# EasyEDA Pro project board.epro

# Schematic Schematic1
Board Name: Board1; Create Date: 2026-03-25; Page Name: P1; Project Name: jog controller; Schematic Name: Schematic1; Update Date: 2026-03-25; Company: EasyEDA.com; Page Size: A4; Version: V1.0
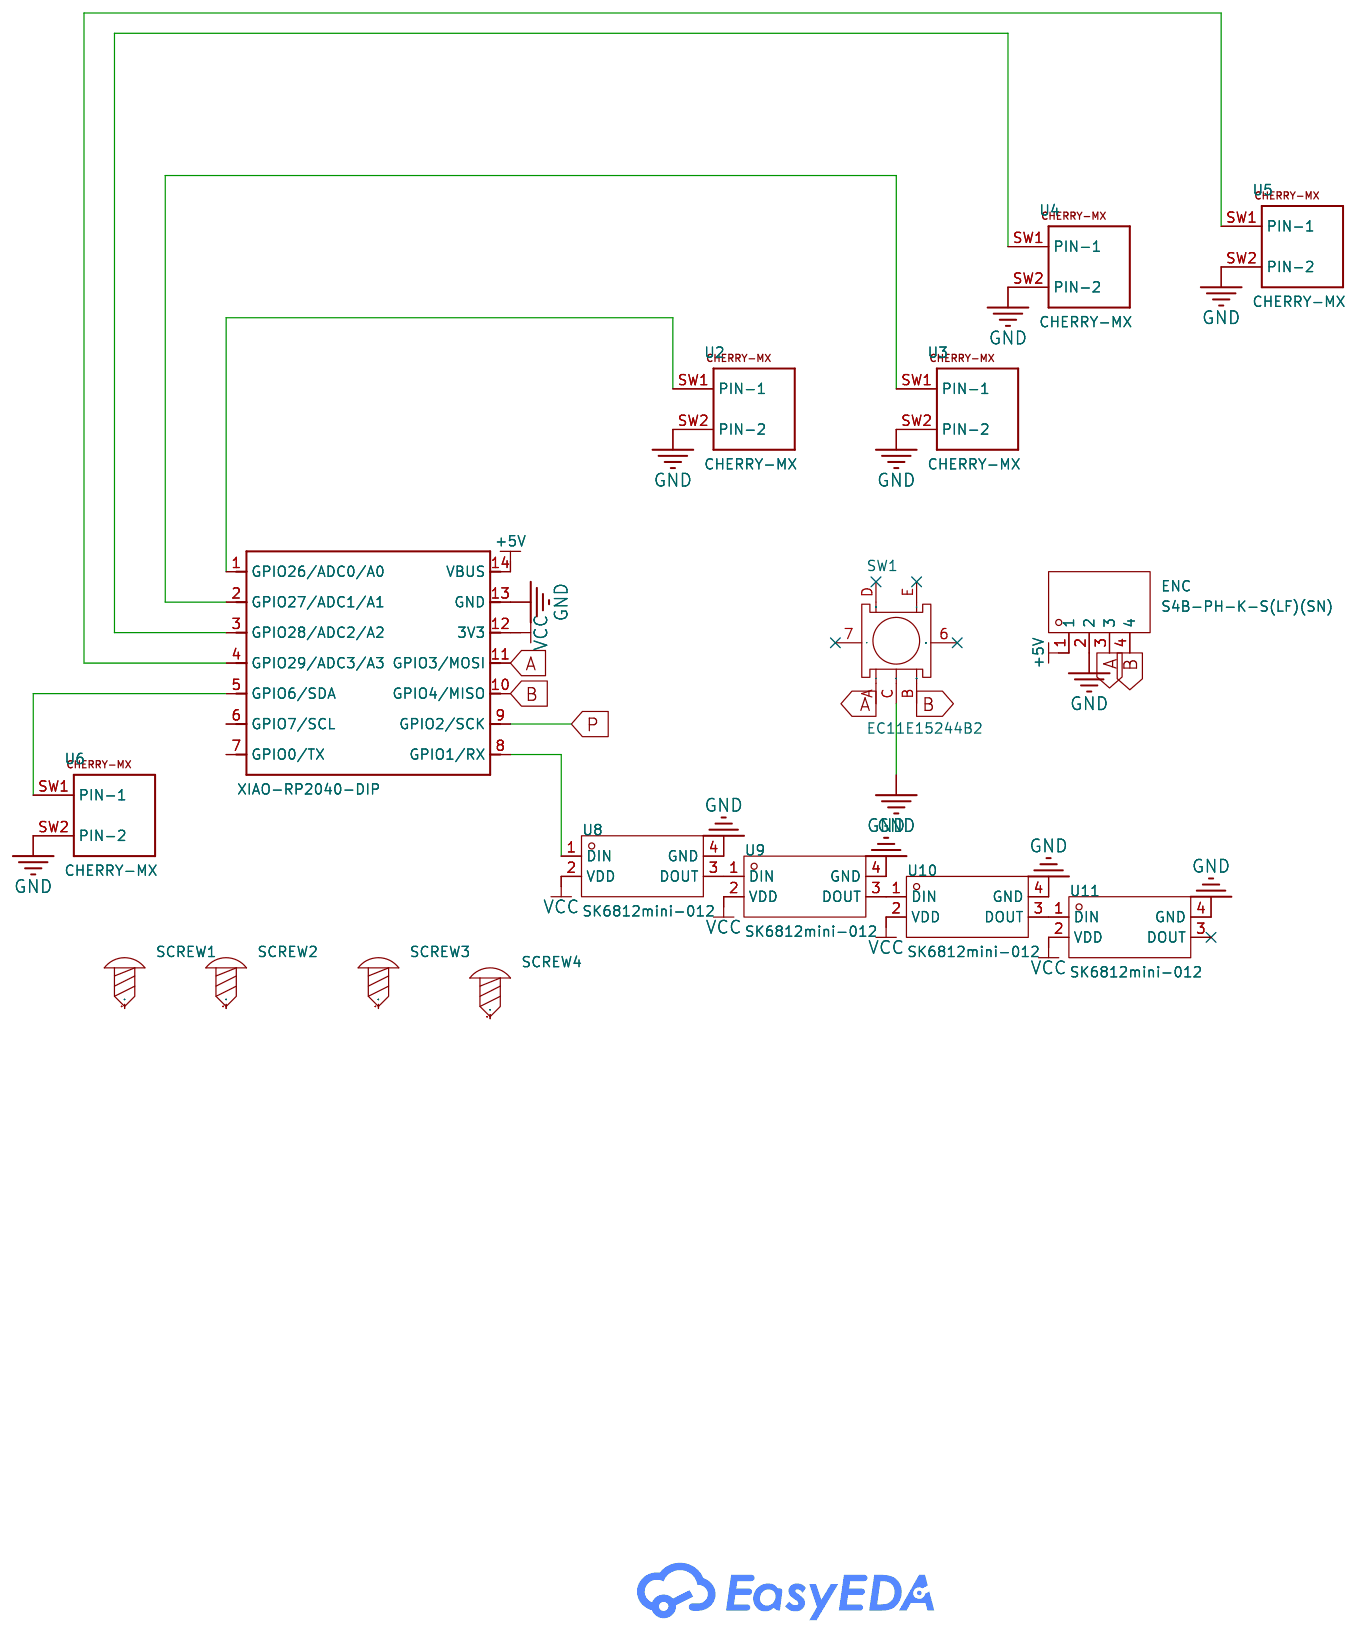
[diagram p0: schematic sheet]

## Parts
ENC  S4B-PH-K-S(LF)(SN)  [CONN-TH_4P-P2.00_S4B-PH-K-S-LF-SN]
SCREW1  -  [Screw-Hole-M3]
SCREW2  -  [Screw-Hole-M3]
SCREW3  -  [Screw-Hole-M3]
SCREW4  -  [Screw-Hole-M3]
SW1  EC11E15244B2  [SW-TH_EC11XXXXXXXX]
U1  XIAO-RP2040-DIP  [XIAO-RP2040-DIP]
U2  CHERRY-MX  [CHERRY-MX]
U3  CHERRY-MX  [CHERRY-MX]
U4  CHERRY-MX  [CHERRY-MX]
U5  CHERRY-MX  [CHERRY-MX]
U6  CHERRY-MX  [CHERRY-MX]
U8  SK6812mini-012  [LED-SMD_4P-L3.7-W3.5-P1.75-BR-SK6812MINI]
U9  SK6812mini-012  [LED-SMD_4P-L3.7-W3.5-P1.75-BR-SK6812MINI]
U10  SK6812mini-012  [LED-SMD_4P-L3.7-W3.5-P1.75-BR-SK6812MINI]
U11  SK6812mini-012  [LED-SMD_4P-L3.7-W3.5-P1.75-BR-SK6812MINI]

## Library data of the parts
ENC = S4B-PH-K-S(LF)(SN): Pins Structure:1x4P Pitch:2mm Mounting Type:Right Angle Reference Series:PH Number of Pins:4P Number of Rows:1 Number of PINs Per Row:4 Row Spacing:- Current Rating:2A Contact Material:Brass Contact Plating:Tin Operating Temperature:-25℃~+85℃ Operating Te; LCSC Part Name: 1x4P 间距:2mm 弯插 系列:PH; Supplier Part: C157926; Manufacturer: JST; Supplier Footprint: 弯插,P=2mm; JLCPCB Part Class: Extended Part; Datasheet: https://item.szlcsc.com/datasheet/S4B-PH-K-S(LF)(SN)/169274.html; Supplier: LCSC; Pins Structure: 1x4P; Pitch: 2mm; Mounting Type: Right Angle; Reference Series: PH; Number of Pins: 4P; Number of Rows: 1; Number of PINs Per Row: 4; Current Rating: 2A; Contact Material: Brass; Contact Plating: Tin; Operating Temperature: -25℃~+85℃; Voltage Rating: 100V; Plastic Material: PA66; Flame Retardant Rating: UL94V-0; Supplementary Features: K Pin; Color: White; Z-Height of the Board: 4.8mm; X-Length of Bottom Edge on Board (Spacing Line): 9.9mm; Y-Width of Bottom Edge on Board: 7.6mm
SCREW1-SCREW4 = Screw-Hole-M3: Supplier Footprint: 插件
SW1 = EC11E15244B2_C470754: Supplier Part: C470754; Manufacturer: ALPSALPINE(阿尔卑斯阿尔派); Supplier Footprint: 插件; JLCPCB Part Class: Extended Part; Datasheet: https://atta.szlcsc.com/upload/public/pdf/source/20191216/C470795_DE763ECE59BD49533DB26DB53E5D34B2.pdf; Supplier: LCSC
U1 = XIAO-RP2040-DIP
U2-U6 = CHERRY-MX
U8-U11 = SK6812mini-012: Wavelength:B:465nm~475nm；R:615nm~625nm；G:520nm~530nm Luminous Intensity:B:200mcd~385mcd；R:280mcd~515mcd；G:815mcd~1275mcd Fixed-Frequency Pwm Mode:1kHz Data Transmission Rate:800Kbit/s Voltage - Supply:3.7V~5.5V Voltage - Supply:3.7V~5.5V Quiescent Current; LCSC Part Name: 工作电压5V 发光角度120° 单线归零码传输协议LED; Supplier Part: C2886570; Manufacturer: 欧思科光电; Supplier Footprint: SMD; JLCPCB Part Class: Extended Part; Datasheet: https://item.szlcsc.com/datasheet/SK6812mini-012/3100934.html; Supplier: LCSC; Wavelength: B:465nm~475nm；R:615nm~625nm；G:520nm~530nm; Luminous Intensity: B:200mcd~385mcd；R:280mcd~515mcd；G:815mcd~1275mcd; Fixed-Frequency Pwm Mode: 1kHz; Data Transmission Rate: 800Kbit/s; Voltage - Supply: 3.7V~5.5V; Quiescent Current: 0.6mA; Lens Color: Semi-transparent lens; ESD Withstand Voltage: 2000V; Operating Temperature: -40℃~+85℃; Viewing Angle: 120°; Length: 3.7mm; Width: 1.1mm; Height: 3.5mm

## Nets
+5V: ENC.1 U1.14(VBUS)
GND: ENC.2 SW1.C U1.13(GND) U2.SW2(PIN-2) U3.SW2(PIN-2) U4.SW2(PIN-2) U5.SW2(PIN-2) U6.SW2(PIN-2) U8.4(GND) U9.4(GND) U10.4(GND) U11.4(GND)
VCC: U1.12(3V3) U8.2(VDD) U9.2(VDD) U10.2(VDD) U11.2(VDD)
A: ENC.3 SW1.A U1.11(GPIO3/MOSI)
B: ENC.4 SW1.B U1.10(GPIO4/MISO)
P: U1.9(GPIO2/SCK)
$1N3391: U1.1(GPIO26/ADC0/A0) U2.SW1(PIN-1)
$1N3400: U1.2(GPIO27/ADC1/A1) U3.SW1(PIN-1)
$1N3443: U1.3(GPIO28/ADC2/A2) U4.SW1(PIN-1)
$1N3478: U1.4(GPIO29/ADC3/A3) U5.SW1(PIN-1)
$1N3762: U1.5(GPIO6/SDA) U6.SW1(PIN-1)
$1N4104: U1.8(GPIO1/RX) U8.1(DIN)
$1N4156: U8.3(DOUT) U9.1(DIN)
$1N4207: U9.3(DOUT) U10.1(DIN)
$1N4258: U10.3(DOUT) U11.1(DIN)

Not connected (* = marked no-connect by the designer): SCREW1 1; SCREW2 1; SCREW3 1; SCREW4 1; SW1 6* 7* D* E*; U1 6(GPIO7/SCL) 7(GPIO0/TX); U11 3(DOUT)*

# Board PCB1
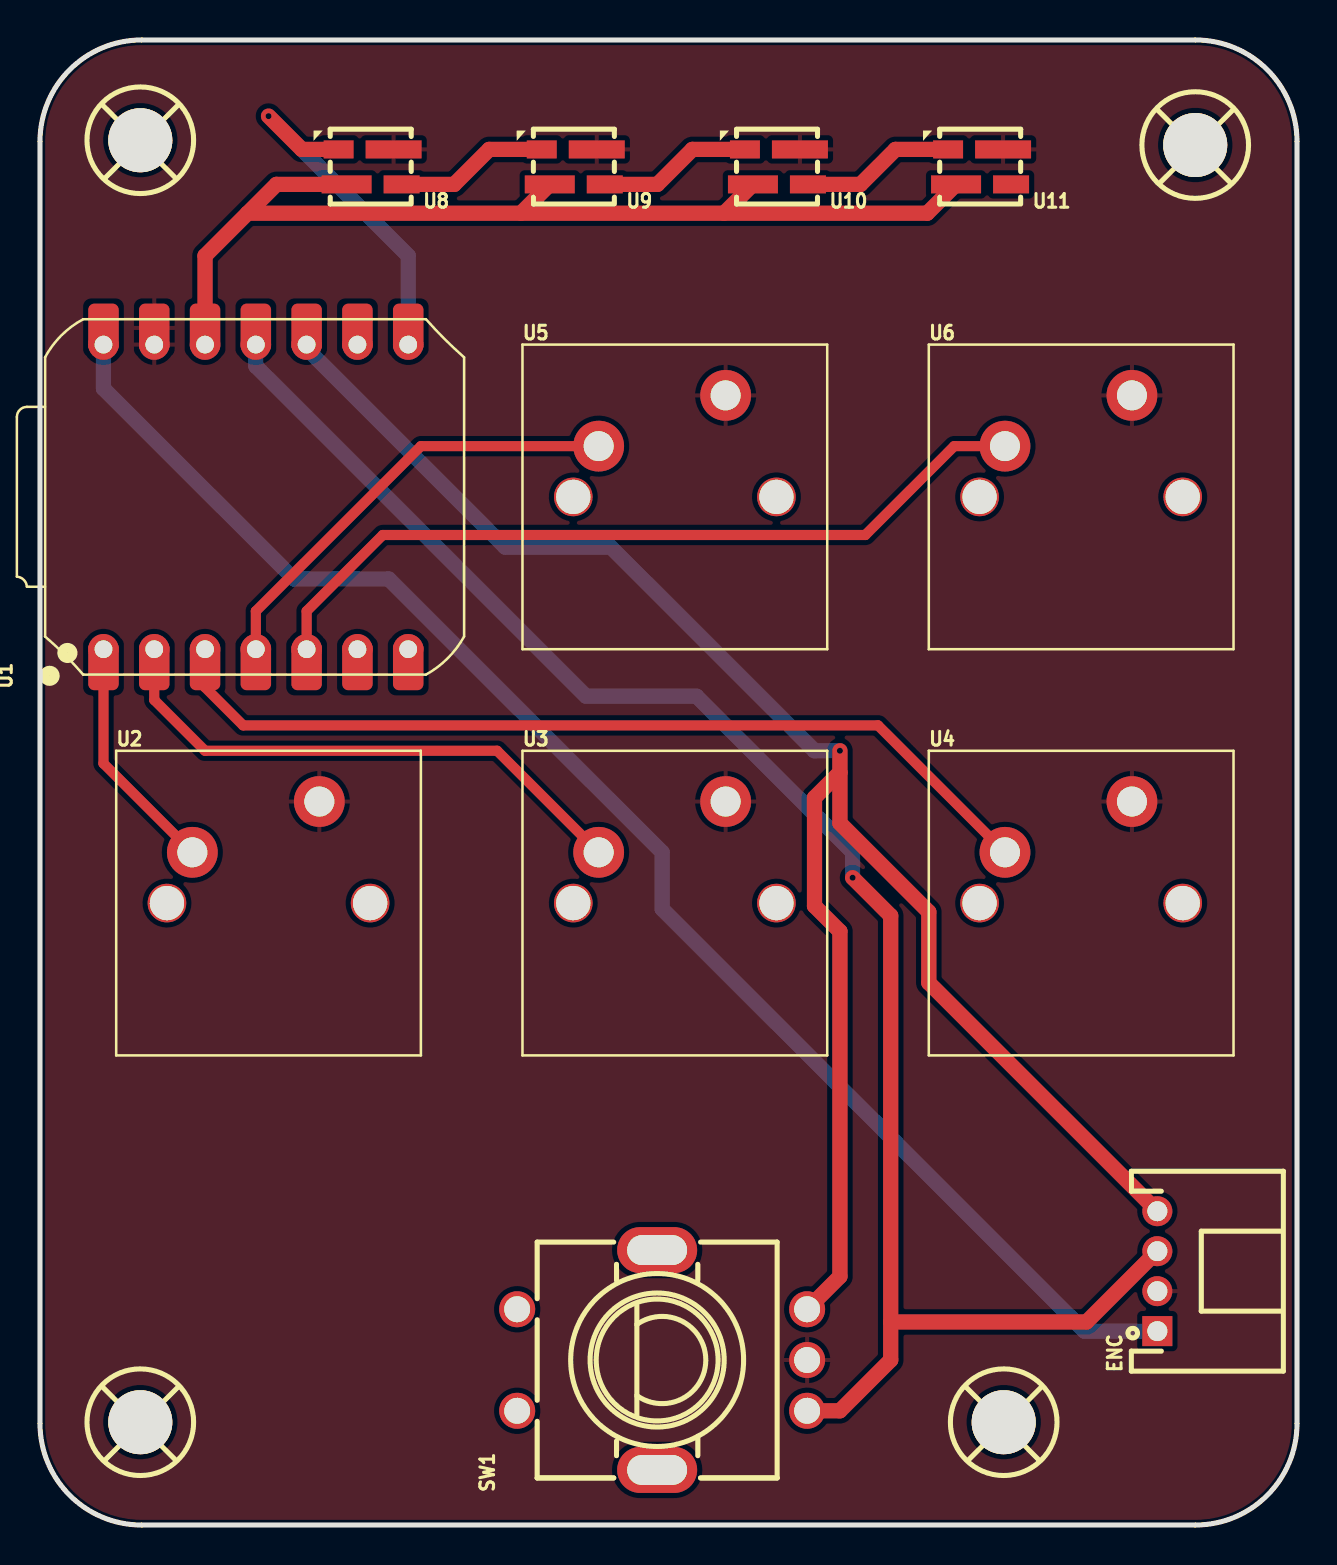
[diagram p1: board, top side]
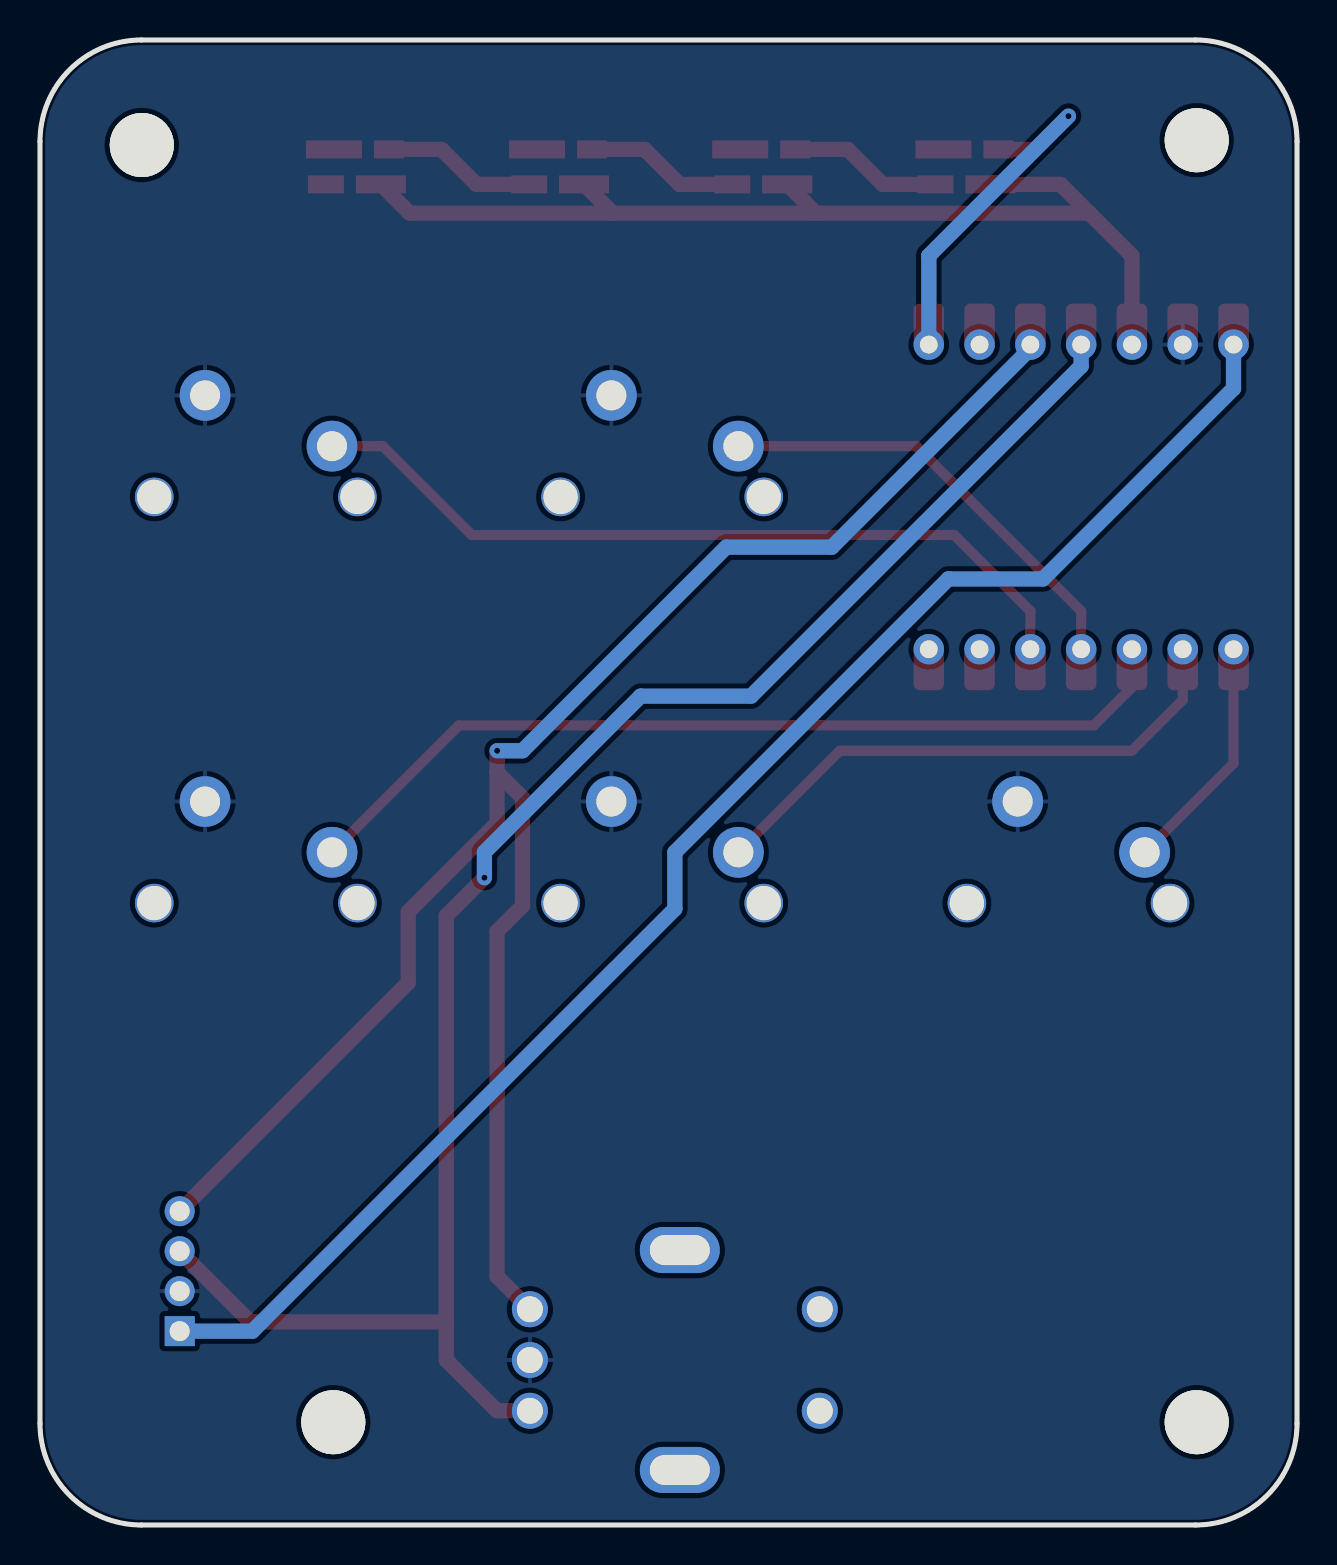
[diagram p2: board, bottom side, seen from below]

Outline 62.86 x 74.29 mm; copper layers: Top Layer, Bottom Layer. Coordinates in mm from the lower left corner of the outline.
Outline path: 0,69.21 0,5.08 arc(1.49,1.49) 5.08,0 57.79,0 arc(61.38,1.49) 62.86,5.08 62.86,69.21 arc(61.38,72.81) 57.79,74.29 5.08,74.29 arc(1.49,72.81) 0,69.21
Stack: Top Layer 0.035mm / Dielectric1 1.51mm FR4 er 4.5 / Bottom Layer 0.035mm

## Design rules (mm)
template: JLCPCB Capability(Two Layers Board)
spacing copperThickness1oz (default): track to track 0.102, other pairs 0.152 to 0.3
spacing copperThickness2oz: track to track 0.203, other pairs 0.152 to 0.3
track width copperThickness1oz (default): min 0.127, default 0.254, max 2.54
track width copperThickness2oz: min 0.203, default 0.254, max 2.54
differential pair differentialPair (default): width min 0.127, default 0.254, max 2.54; gap min 0.152, default 0.152
via viaSize (default): diameter min 0.5, default 0.61, max 10; hole min 0.3, default 0.305, max 6.3

## Placement (name value [footprint] x y rotation side)
ENC  S4B-PH-K-S(LF)(SN)  [CONN-TH_4P-P2.00_S4B-PH-K-S-LF-SN]  55.88 12.7 90 top
SCREW1  -  [Screw-Hole-M3]  5.08 69.21 0 top
SCREW2  -  [Screw-Hole-M3]  57.84 68.97 0 top
SCREW3  -  [Screw-Hole-M3]  48.26 5.08 0 top
SCREW4  -  [Screw-Hole-M3]  5.08 5.08 0 top
SW1  EC11E15244B2  [SW-TH_EC11XXXXXXXX]  31.11 8.25 90 top
U1  -  [XIAO-RP2040-DIP]  10.8 51.43 90 top
U2  -  [CHERRY-MX]  11.43 31.11 0 top
U3  -  [CHERRY-MX]  31.75 31.11 0 top
U4  -  [CHERRY-MX]  52.07 31.11 0 top
U5  -  [CHERRY-MX]  31.75 51.43 0 top
U6  -  [CHERRY-MX]  52.07 51.43 0 top
U8  SK6812mini-012  [LED-SMD_4P-L3.7-W3.5-P1.75-BR-SK6812MINI]  16.51 67.94 180 top
U9  SK6812mini-012  [LED-SMD_4P-L3.7-W3.5-P1.75-BR-SK6812MINI]  26.67 67.94 180 top
U10  SK6812mini-012  [LED-SMD_4P-L3.7-W3.5-P1.75-BR-SK6812MINI]  36.83 67.94 180 top
U11  SK6812mini-012  [LED-SMD_4P-L3.7-W3.5-P1.75-BR-SK6812MINI]  46.99 67.94 180 top

## Footprints (pads in the part's own frame, mm; a bottom-side part is the same pattern mirrored in y, then rotated)
CHERRY-MX
  round 1.931 hole 1.714: P$3(-5.08,0) P$4(5.08,0)
  round 2.54 hole 1.5: SW1(-3.81,2.54) SW2(2.54,5.08)
CONN-TH_4P-P2.00_S4B-PH-K-S-LF-SN
  rect 1.5x1.5 hole 1: 1(-3,0)
  round 1.5 hole 1: 2(-1,0) 3(1,0) 4(3,0)
LED-SMD_4P-L3.7-W3.5-P1.75-BR-SK6812MINI
  rect 1.5x0.9 smd: 1(1.575,-0.875)
  rect 2.5x0.9 smd: 2(1.175,0.875)
  rect 1.8x0.9 smd: 3(-1.575,0.875)
  rect 2.8x0.9 smd: 4(-1.175,-0.875)
Screw-Hole-M3
  round 3.2 hole 3.2: 1(-0.064,0.064)
SW-TH_EC11XXXXXXXX
  oval 2.3x4 hole 1.5x3: 6(5.5,0.25) 7(-5.5,0.25)
  round 1.8 hole 1.3: A(-2.54,-7.25) B(2.54,-7.25) C(0,-7.25) D(-2.54,7.25) E(2.54,7.25)
XIAO-RP2040-DIP
  rrect 2.432x1.524 smd: 1(-8.455,7.62) 2(-8.455,5.08) 3(-8.455,2.54) 4(-8.455,0) 5(-8.455,-2.54) 6(-8.455,-5.08) 7(-8.455,-7.62) 8(8.455,-7.62) 9(8.455,-5.08) 10(8.455,-2.54) 11(8.455,0) 12(8.455,2.54) 13(8.455,5.08) 14(8.455,7.62)
  round 1.524 hole 0.889: 1(-7.62,7.62) 2(-7.62,5.08) 3(-7.62,2.54) 4(-7.62,0) 5(-7.62,-2.54) 6(-7.62,-5.08) 7(-7.62,-7.62) 8(7.62,-7.62) 9(7.62,-5.08) 10(7.62,-2.54) 11(7.62,0) 12(7.62,2.54) 13(7.62,5.08) 14(7.62,7.62)

## Nets
As in the schematic.

Pads without a net: SCREW1 1; SCREW2 1; SCREW3 1; SCREW4 1; SW1 6 7 D E; U1 6 7; U2 P$3 P$4; U3 P$3 P$4; U4 P$3 P$4; U5 P$3 P$4; U6 P$3 P$4; U11 3

## Via types
v1: diameter 0.61, hole 0.305, Top Layer to Bottom Layer, 3 vias

## Routing (per net, layer and track width the routed paths; a pad name or vN(x,y) marks a point on that pad's centre or on a via; arc(x,y) is an arc through that point)
+5V: length 76.1
  Bottom Layer w0.762: ENC.1 52.24,9.7 31.11,30.82 31.11,33.65 17.44,47.33 12.7,47.33 3.17,56.86 U1.14
VCC: length 53.1
  Top Layer w0.762: U1.12 8.25,63.5 10.38,65.63 ; 45.82,67.07 44.37,65.63 34.21,65.63 ; 10.38,65.63 24.05,65.63 ; 10.38,65.63 11.83,67.07 U8.2 ; 24.05,65.63 34.21,65.63 ; 24.05,65.63 U9.2 ; 34.21,65.63 35.66,67.07
A: length 87.2
  Top Layer w0.762: 42.55,10.16 42.55,8.25 40.01,5.72 SW1.A ; 42.55,10.16 42.55,30.48 v1(40.64,32.38) ; 42.55,10.16 52.34,10.16 ENC.3
  Bottom Layer w0.762: U1.11 10.8,57.98 27.3,41.47 32.83,41.47 40.64,33.65 v1(40.64,32.38)
B: length 93.4
  Top Layer w0.762: SW1.B 40.01,12.43 40.01,29.7 38.73,30.97 38.73,36.39 40.01,37.66 ; 40.01,37.66 40.01,35.12 44.45,30.67 44.45,27.13 ENC.4 ; 40.01,37.66 v1(40.01,38.73)
  Bottom Layer w0.762: v1(40.01,38.73) 38.73,38.73 28.55,48.92 23.27,48.92 13.33,58.85 U1.10
$1N3391: length 11.2
  Top Layer w0.508: U1.1 3.17,38.1 U2.SW1
$1N3400: length 27.9
  Top Layer w0.508: U1.2 5.72,41.27 8.25,38.73 22.86,38.73 U3.SW1
$1N3443: length 45.3
  Top Layer w0.508: U1.3 8.25,41.91 10.16,40 41.91,40 U4.SW1
$1N3478: length 22.5
  Top Layer w0.508: U1.4 10.8,45.72 19.05,53.97 U5.SW1
$1N3762: length 40.2
  Top Layer w0.508: U6.SW1 45.72,53.97 41.27,49.53 17.14,49.53 13.33,45.72 U1.5
$1N4104: length 18.5
  Top Layer w0.762: 14.93,68.82 13.1,68.82 v1(11.43,70.48)
  Bottom Layer w0.762: U1.8 18.42,63.5 v1(11.43,70.48)
$1N4156: length 7.7
  Top Layer w0.762: U8.3 20.71,67.07 22.46,68.82 U9.1
$1N4207: length 7.7
  Top Layer w0.762: U9.3 30.88,67.07 32.63,68.82 U10.1
$1N4258: length 7.7
  Top Layer w0.762: U11.1 42.79,68.82 41.04,67.07 U10.3

## Copper pours and planes (outline as drawn; the poured copper is in the pictures)
GND on Top Layer: -4.44,75.56 67.31,75.56 67.31,-5.08 -4.44,-5.08
GND on Bottom Layer: -17.14,78.1 69.21,78.1 69.21,-11.43 -17.14,-11.43
